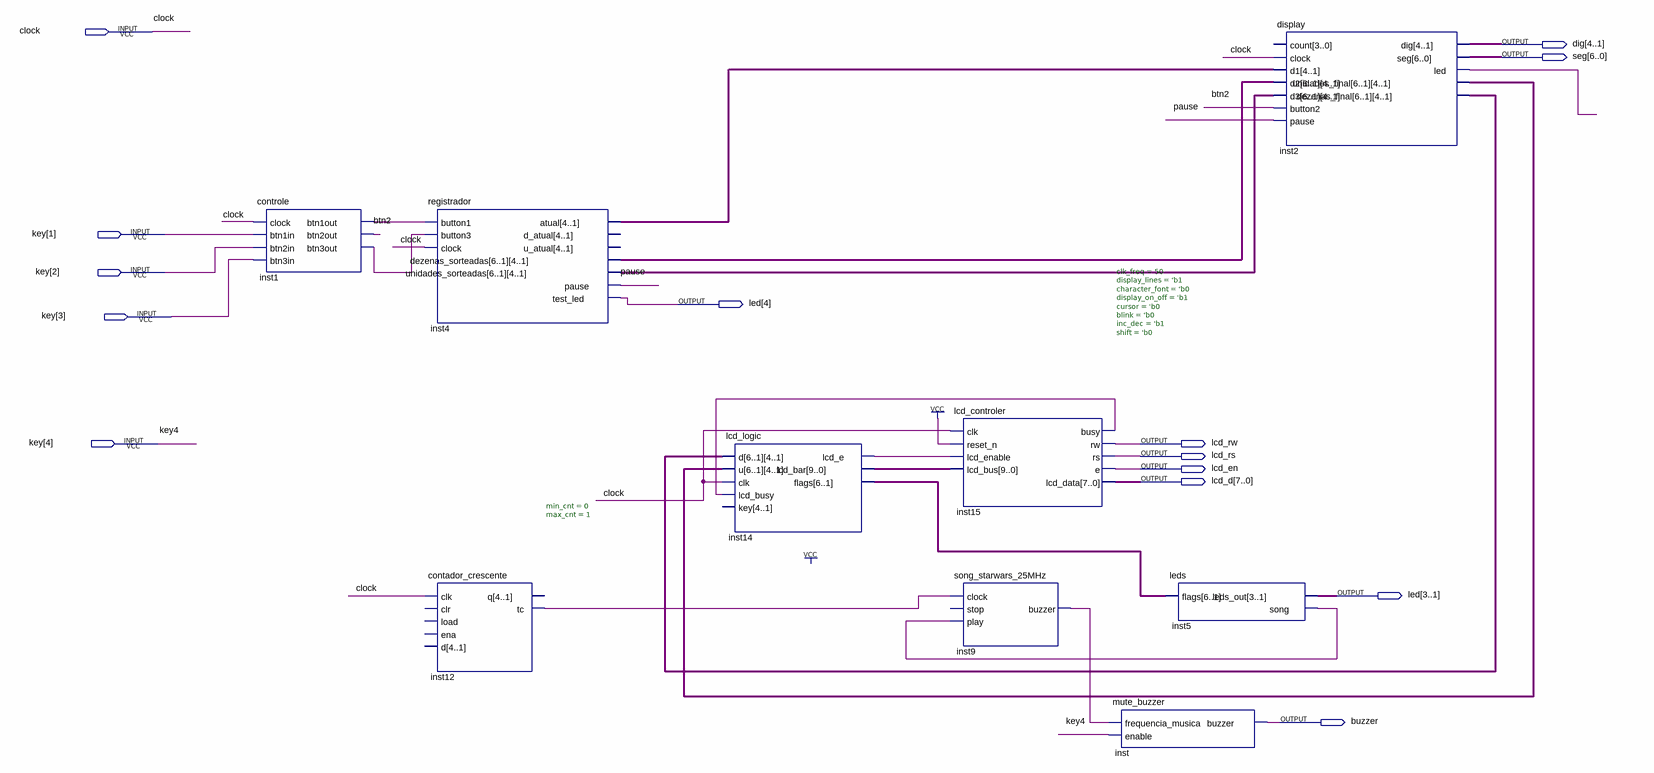
[diagram p0: schematic sheet]
// Quartus schematic projeto2.bdf as structural Verilog: 9 symbols, 14 pins
module projeto2 (
  input  clock,
  input  [4:1] key,
  output [4:1] dig,
  output [6:0] seg,
  output [4:1] led,
  output lcd_rw,
  output lcd_rs,
  output lcd_en,
  output [7:0] lcd_d,
  output buzzer
);

  wire btn2, inst1_btn1out, inst1_btn3out, inst2_led, inst5_song, inst9_buzzer, inst12_tc, inst14_lcd_e,
       inst15_busy, pause;
  wire [3:0] inst4_atual;
  wire [5:0] inst14_flags;
  wire [9:0] inst14_lcd_bar;
  wire [23:0] inst2_dezenas_final, inst2_unidades_final, inst4_dezenas_sorteadas, inst4_unidades_sorteadas;

  controle inst1 (
    .clock(clock), .btn1in(key[1]), .btn2in(key[2]), .btn3in(key[3]), .btn1out(inst1_btn1out),
    .btn2out(btn2), .btn3out(inst1_btn3out));
  registrador inst4 (
    .button1(inst1_btn1out), .button3(inst1_btn3out), .clock(clock), .atual(inst4_atual),
    .dezenas_sorteadas(inst4_dezenas_sorteadas), .unidades_sorteadas(inst4_unidades_sorteadas),
    .pause(pause), .test_led(led[4]));  // open: d_atual, u_atual
  contador_crescente #(.min_cnt(0), .max_cnt(1)) inst12 (.clk(clock), .tc(inst12_tc));  // open: clr, load, ena, d, q
  lcd_logic inst14 (
    .d(inst2_dezenas_final), .u(inst2_unidades_final), .clk(clock), .lcd_busy(inst15_busy),
    .lcd_e(inst14_lcd_e), .lcd_bar(inst14_lcd_bar), .flags(inst14_flags));  // open: key
  lcd_controler #(.clk_freq(50), .display_lines('b1), .character_font('b0), .display_on_off('b1), .cursor('b0), .blink('b0), .inc_dec('b1), .shift('b0)) inst15 (
    .clk(clock), .reset_n(1'b1), .lcd_enable(inst14_lcd_e), .lcd_bus(inst14_lcd_bar), .busy(inst15_busy),
    .rw(lcd_rw), .rs(lcd_rs), .e(lcd_en), .lcd_data(lcd_d));
  song_starwars_25MHz inst9 (.clock(inst12_tc), .play(inst5_song), .buzzer(inst9_buzzer));  // open: stop
  mute_buzzer inst (.frequencia_musica(inst9_buzzer), .enable(key[4]), .buzzer(buzzer));
  leds inst5 (.flags(inst14_flags), .leds_out(led[3:1]), .song(inst5_song));
  display inst2 (
    .clock(clock), .d1(inst4_atual), .d2(inst4_dezenas_sorteadas), .d3(inst4_unidades_sorteadas),
    .button2(btn2), .pause(pause), .dig(dig), .seg(seg), .led(inst2_led),
    .unidades_final(inst2_unidades_final), .dezenas_final(inst2_dezenas_final));  // open: count
endmodule
